# Altium schematic sheet DRV8901E.SchDoc
size A3; SheetNumber: 1; SheetTotal: 2
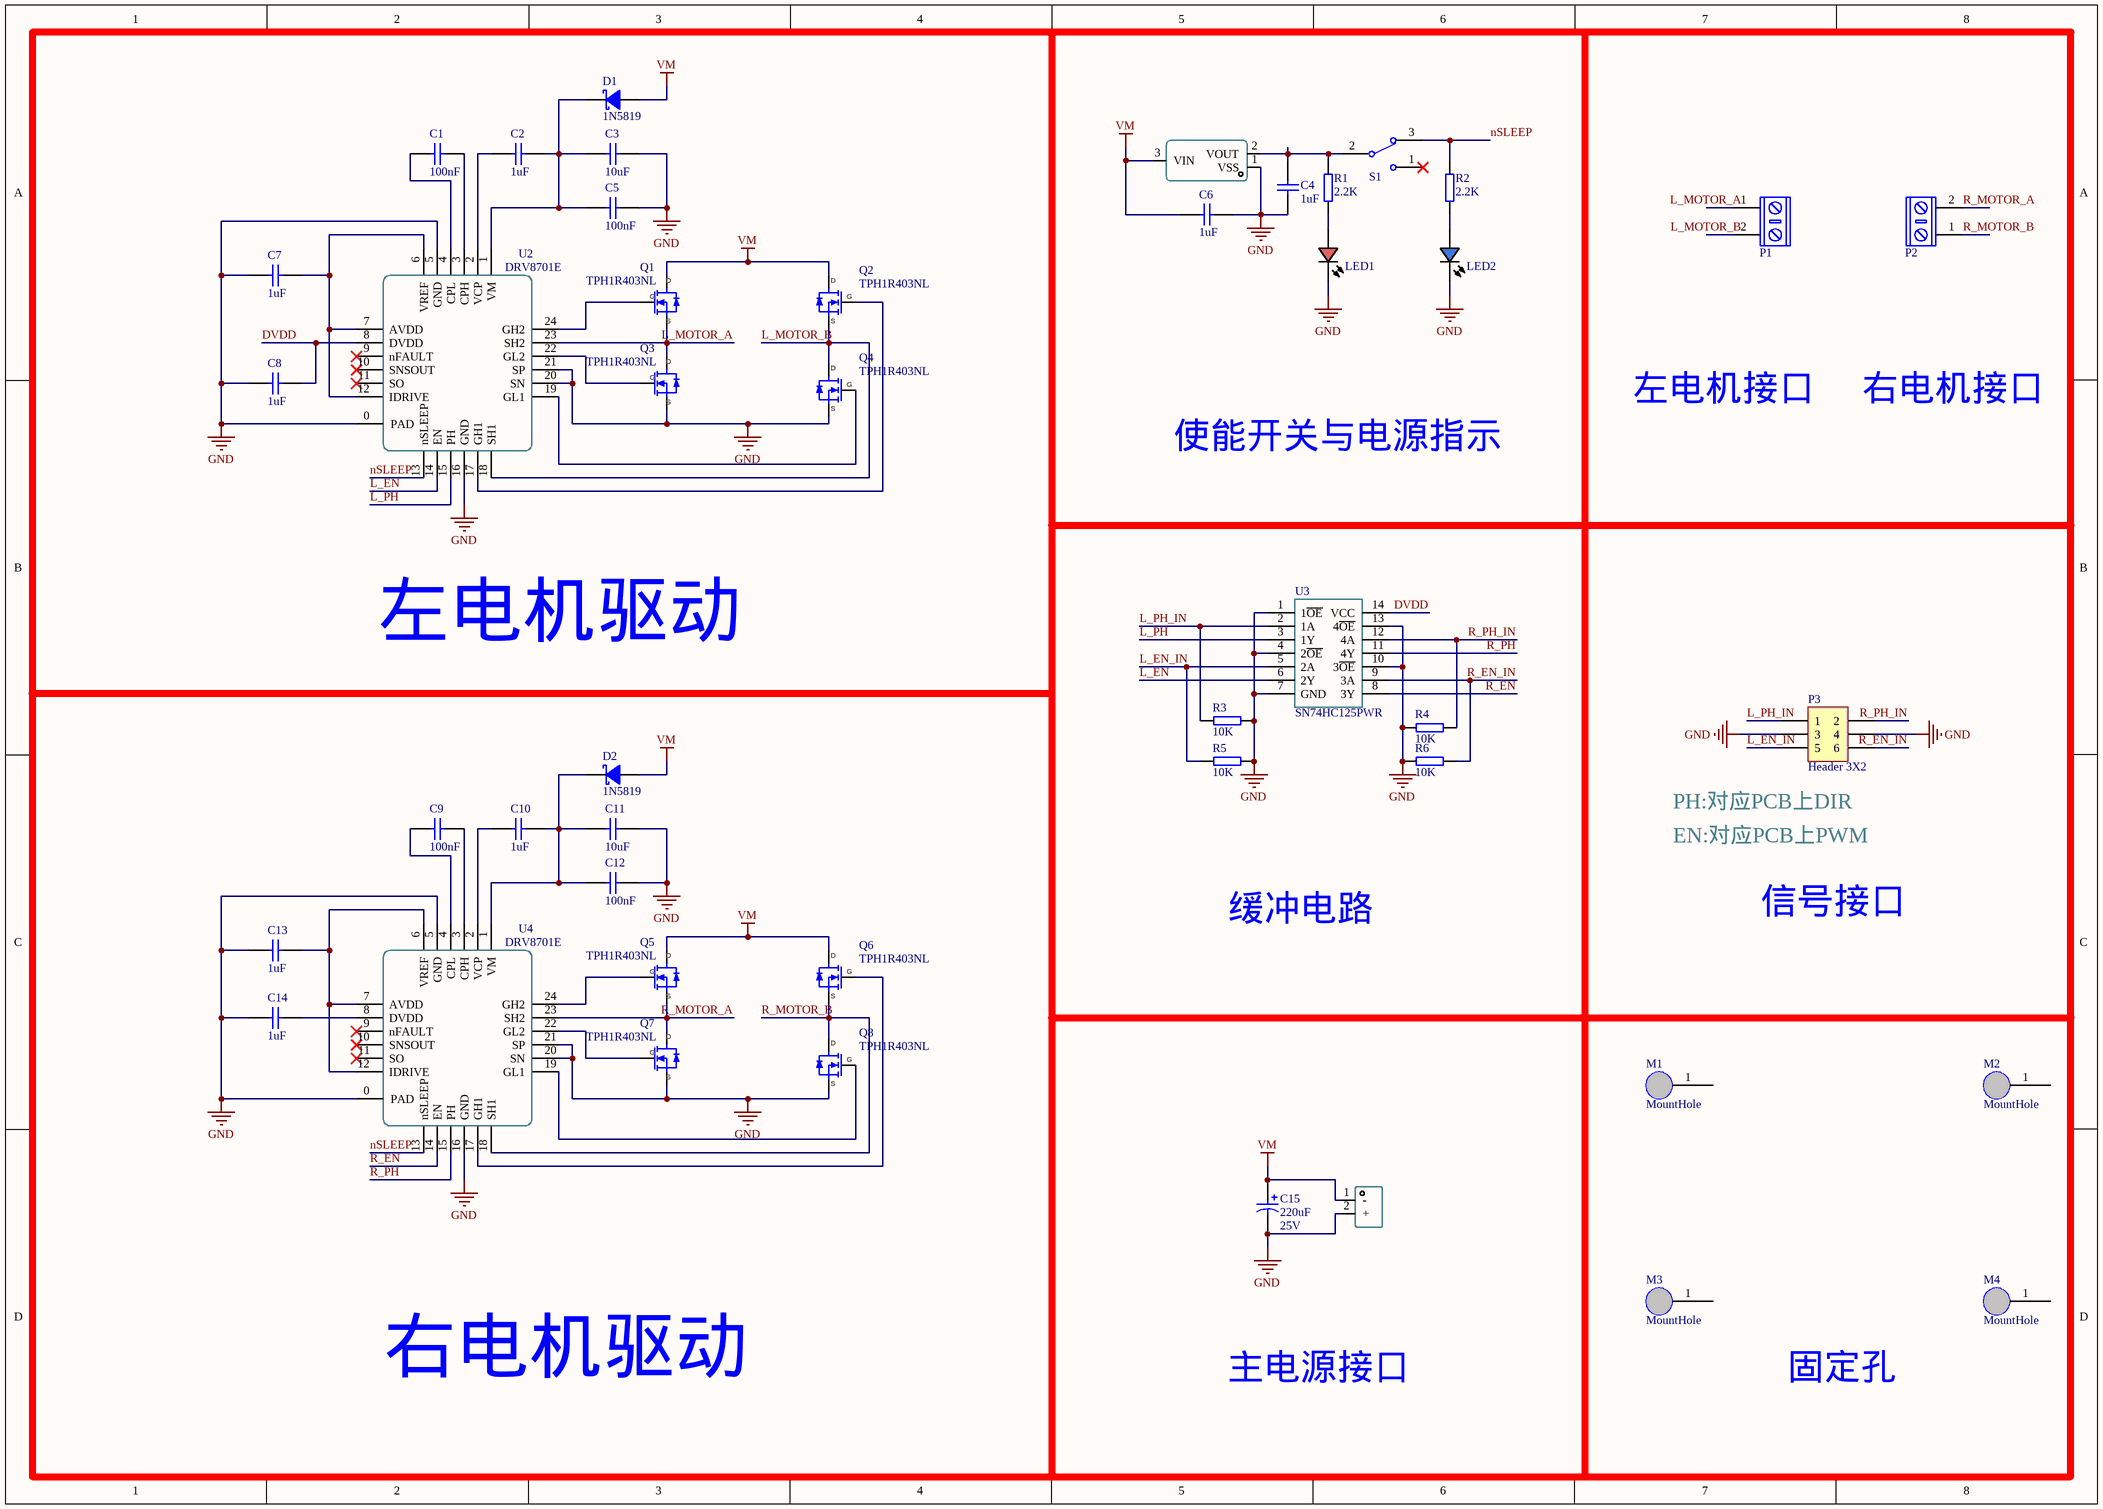
[diagram p0: DRV8901E.SchDoc]

## Parts
C1  value 100nF  [CAPC2012[0805]S-N]  (hidden comment: 100nF ±10% 50V)
C2  value 1uF  [CAPC2012[0805]S-N]  (hidden comment: 1uF ±10% 25V)
C3  value 10uF  [CAPC2012[0805]S-N]  (hidden comment: 10uF ±10% 25V)
C4  value 1uF  [CAPC2012[0805]S-N]  (hidden comment: 1uF ±10% 25V)
C5  value 100nF  [CAPC2012[0805]S-N]  (hidden comment: 100nF ±10% 50V)
C6  value 1uF  [CAPC2012[0805]S-N]  (hidden comment: 1uF ±10% 25V)
C7  value 1uF  [CAPC2012[0805]S-N]  (hidden comment: 1uF ±10% 25V)
C8  value 1uF  [CAPC2012[0805]S-N]  (hidden comment: 1uF ±10% 25V)
C9  value 100nF  [CAPC2012[0805]S-N]  (hidden comment: 100nF ±10% 50V)
C10  value 1uF  [CAPC2012[0805]S-N]  (hidden comment: 1uF ±10% 25V)
C11  value 10uF  [CAPC2012[0805]S-N]  (hidden comment: 10uF ±10% 25V)
C12  value 100nF  [CAPC2012[0805]S-N]  (hidden comment: 100nF ±10% 50V)
C13  value 1uF  [CAPC2012[0805]S-N]  (hidden comment: 1uF ±10% 25V)
C14  value 1uF  [CAPC2012[0805]S-N]  (hidden comment: 1uF ±10% 25V)
C15  value 220uF  Voltage: 25V  [CAP-E-S 6.3]  (hidden comment: 220uF 25V)
D1  1N5819  [SOD-123-L]
D2  1N5819  [SOD-123-L]
LED1  (no value)  [LED_0805]
LED2  Blue  [LED_0805]  (value not drawn)
M1  MountHole  [M3-MountSlot]  (no BOM)
M2  MountHole  [M3-MountSlot]  (no BOM)
M3  MountHole  [M3-MountSlot]  (no BOM)
M4  MountHole  [M3-MountSlot]  (no BOM)
P1  KF/WJ/DG 30x connecter  [KF/WJ/DG 301-2p-5.0mm]  (value not drawn)
P2  KF/WJ/DG 30x connecter  [KF/WJ/DG 301-2p-5.0mm]  (value not drawn)
P3  Header 3X2  [HDR2X3]
Q1  TPH1R403NL  [DFN5x6]
Q2  TPH1R403NL  [DFN5x6]
Q3  TPH1R403NL  [DFN5x6]
Q4  TPH1R403NL  [DFN5x6]
Q5  TPH1R403NL  [DFN5x6]
Q6  TPH1R403NL  [DFN5x6]
Q7  TPH1R403NL  [DFN5x6]
Q8  TPH1R403NL  [DFN5x6]
R1  value 2.2K  [R0805]  (hidden comment: 2.2K ±1%)
R2  value 2.2K  [R0805]  (hidden comment: 2.2K ±1%)
R3  value 10K  [R0805]  (hidden comment: 10K ±1%)
R4  value 10K  [R0805]  (hidden comment: 10K ±1%)
R5  value 10K  [R0805]  (hidden comment: 10K ±1%)
R6  value 10K  [R0805]  (hidden comment: 10K ±1%)
S1  SW-SPDT  [SS12D10]  (value not drawn)
U1  LR8341A-T33  [SOT-23-3L_L2.9-W1.6-P1.90-LS2.8-BL]  (value not drawn)
U2  DRV8701E  [QFN24-4x4]
U3  SN74HC125PWR  [TSSOP-14]
U4  DRV8701E  [QFN24-4x4]
U5  XT60  [CONN-TH_XT60]  (value not drawn)

## Nets
GND: C3.2 C4.1 C5.2 C6.1 C7.1 C8.1 C11.2 C12.2 C13.1 C14.1 C15.2 LED1.C LED2.C P3.3 P3.4 Q3.3(S) Q4.3(S) Q7.3(S) Q8.3(S) R3.2 R4.2 R5.2 R6.2 U1.1(VSS) U2.0(PAD) U2.5(GND) U2.16(GND) U2.20(SN) U2.21(SP) U3.1(1~{OE}) U3.4(2~{OE}) U3.7(GND) U3.10(3~{OE}) U3.13(4~{OE}) U4.0(PAD) U4.5(GND) U4.16(GND) U4.20(SN) U4.21(SP) U5.2(+)
VM: C6.2 C15.1 D1.A D2.A Q1.1(D) Q2.1(D) Q5.1(D) Q6.1(D) U1.3(VIN) U5.1(-)
DVDD: C8.2 U2.8(DVDD) U3.14(VCC)
L_EN: U2.14(EN) U3.6(2Y)
L_EN_IN: P3.5 R5.1 U3.5(2A)
L_MOTOR_A: P1.1 Q1.3(S) Q3.1(D) U2.23(SH2)
L_MOTOR_B: P1.2 Q2.3(S) Q4.1(D) U2.18(SH1)
L_PH: U2.15(PH) U3.3(1Y)
L_PH_IN: P3.1 R3.1 U3.2(1A)
nSLEEP: R2.2 S1.3 U2.13(nSLEEP) U4.13(nSLEEP)
R_EN: U3.8(3Y) U4.14(EN)
R_EN_IN: P3.6 R6.1 U3.9(3A)
R_MOTOR_A: P2.2 Q5.3(S) Q7.1(D) U4.23(SH2)
R_MOTOR_B: P2.1 Q6.3(S) Q8.1(D) U4.18(SH1)
R_PH: U3.11(4Y) U4.15(PH)
R_PH_IN: P3.2 R4.1 U3.12(4A)
NetC1_1: C1.1 U2.4(CPL)
NetC1_2: C1.2 U2.3(CPH)
NetC2_1: C2.1 U2.2(VCP)
NetC2_2: C2.2 C3.1 C5.1 D1.K U2.1(VM)
NetC4_2: C4.2 R1.2 S1.2 U1.2(VOUT)
NetC7_2: C7.2 U2.6(VREF) U2.7(AVDD) U2.12(IDRIVE)
NetC9_1: C9.1 U4.4(CPL)
NetC9_2: C9.2 U4.3(CPH)
NetC10_1: C10.1 U4.2(VCP)
NetC10_2: C10.2 C11.1 C12.1 D2.K U4.1(VM)
NetC13_2: C13.2 U4.6(VREF) U4.7(AVDD) U4.12(IDRIVE)
NetC14_2: C14.2 U4.8(DVDD)
NetLED1_A: LED1.A R1.1
NetLED2_A: LED2.A R2.1
NetQ1_2: Q1.2(G) U2.24(GH2)
NetQ2_2: Q2.2(G) U2.17(GH1)
NetQ3_2: Q3.2(G) U2.22(GL2)
NetQ4_2: Q4.2(G) U2.19(GL1)
NetQ5_2: Q5.2(G) U4.24(GH2)
NetQ6_2: Q6.2(G) U4.17(GH1)
NetQ7_2: Q7.2(G) U4.22(GL2)
NetQ8_2: Q8.2(G) U4.19(GL1)

Not connected (* = marked no-connect by the designer): M1 1; M2 1; M3 1; M4 1; S1 1*; U2 9(nFAULT)* 10(SNSOUT)* 11(SO)*; U4 9(nFAULT)* 10(SNSOUT)* 11(SO)*

## Notes on the sheet
- 使能开关与电源指示
- 左电机接口
- 右电机接口
- 左电机驱动
- (near P3) PH:对应PCB上DIR
- EN:对应PCB上PWM
- 信号接口
- 缓冲电路
- 右电机驱动
- 主电源接口
- 固定孔

## Library data of the parts
C1 C5 C9 C12 = Cap-Chip_1: 贴片电容; Published: 8-Jun-2000; Revision: July-2002: Re-released for DXP Platform.; Publisher: Altium Limited; Price(RMB): 0.000; Voltage: 50V; Tolerance: ±10%
C2 C4 C6-C8 C10 C13 C14 = Cap-Chip_2: 贴片电容; Published: 8-Jun-2000; Revision: July-2002: Re-released for DXP Platform.; Publisher: Altium Limited; Price(RMB): 0.000; Voltage: 25V; Tolerance: ±10%
C3 C11 = Cap-Chip: 贴片电容; Published: 8-Jun-2000; Revision: July-2002: Re-released for DXP Platform.; Publisher: Altium Limited; Price(RMB): 0.000; Voltage: 25V; Tolerance: ±10%
C15 = Cap-Elect: Polarized Capacitor (Radial); Published: 8-Jun-2000; Revision: July-2002: Re-released for DXP Platform.; Publisher: Altium Limited; Price(RMB): 0.000
D1 D2 = Diode Schottky: 肖特基二极管 Diode; Imax: 500mA; Published: 8-Jun-2000; Revision: July-2002: Re-released for DXP Platform.; Publisher: Altium Limited; Price(RMB): 0.000; PartNumber: 1N5819
LED1 = LED Chip Red: Typical Chip LED; Published: 8-Jun-2000; Revision: July-2002: Re-released for DXP Platform.; Publisher: Altium Limited; Price(RMB): 0.00
LED2 = LED Chip Blue: Typical Chip LED; Published: 8-Jun-2000; Revision: July-2002: Re-released for DXP Platform.; Publisher: Altium Limited; Price(RMB): 0.00; Color: Blue
M1-M4 = MountHole: 固定孔
P1 P2 = KF/WJ/DG 30x: 接线端子 2Pin
P3 = Header 3X2: Header, 3-Pin, Dual row; LatestRevisionDate: 17-Jul-2002; LatestRevisionNote: Re-released for DXP Platform.; Publisher: Altium Limited; Price(RMB): 0.00
Q1-Q8 = TPH1R403NL: 东芝 N沟 MOS
R1 R2 = Res-Chip: 贴片电阻; Published: 8-Jun-2000; Revision: July-2002: Re-released for DXP Platform.; Publisher: Altium Limited; Price(RMB): 0.000; Tolerance: ±1%
R3-R6 = Res-Chip_1: 贴片电阻; Published: 8-Jun-2000; Revision: July-2002: Re-released for DXP Platform.; Publisher: Altium Limited; Price(RMB): 0.000; Tolerance: ±1%
S1 = SW-SPDT: 单刀双掷开关 3脚船型、钮子、拨动开关 SPDT Subminiature Toggle Switch; Published: 24-Mar-1999; Publisher: Altium Limited; Price(RMB): 0.000
U1 = LR8341A-T33: Manufacturer: LR(朗瑞); Add into BOM: yes; Output Type: 固定; Maximum Input Voltage: 40V; Output Voltage: 3.3V; MAX Output Current: 100mA; Power Supply Rejection Ratio (PSRR): 55dB@(1kHz); standby current: 2uA; Output Polarity: 正极; Number of Outputs: 1; Name: LR8341A-T33; Symbol: LR8341A-T33; Device: LR8341A-T33; LCSC Part Name: 输入40V 输出3.3V 100mA; Supplier Part: C2829465; Manufacturer Part: LR8341A-T33; Supplier Footprint: SOT-23-3L; JLCPCB Part Class: Extended Part; Datasheet: https://atta.szlcsc.com/upload/public/pdf/source/20210426/C2829465_61F15D7ACE9671B48D4F69A8092B0D8F.pdf; Supplier: LCSC; Convert to PCB: yes; Dropout Voltage: -; Noise: -; Feature: -; Operating Temperature: -40℃~+85℃
U2 U4 = DRV8701E: DRV8701E Ti全桥驱动芯片
U3 = SN74HC125PWR: 三态输出的四路缓冲器 TSSOP-20
U5 = XT60: Manufacturer: AMASS(艾迈斯); Add into BOM: yes; Brand: 艾迈斯; InterfaceType: 公头; specifications: 3.5mm; Name: XT60; Symbol: XT60; Device: XT60; LCSC Part Name: AMASS(艾迈斯) XT60模型插头 3.5mm镀金香蕉头公头（电调端）XT60-M; Supplier Part: C98733; Manufacturer Part: XT60; Supplier Footprint: -; JLCPCB Part Class: Extended Part; Datasheet: https://atta.szlcsc.com/upload/public/pdf/source/20170606/1496716524919.pdf; Supplier: LCSC; Convert to PCB: yes; Model: XT60; Power: -; Output: -; Input: -; Size: -; Interface: -; Type: 香蕉头; Colour: 黄色; MaximumCurrent: -; RatedVoltage: -; Type1: -; NumberOfUSBHoles: -; MetalMaterial: -; InsulationMaterial: -; RatedCurrent: -; RecommendedWireGauge: -; FlameRetardantGrade: -; contact resistance: -; Belt length: -